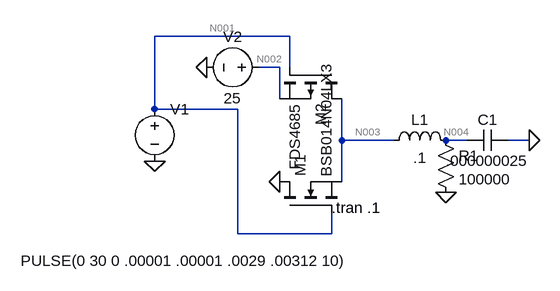
[diagram p0: schematic HornTankCircuit2.asc]
HornTankCircuit2.asc, the LTspice schematic file:
Version 4
SHEET 1 1100 680
WIRE -112 -48 -320 -48
WIRE -128 0 -160 0
WIRE -112 0 -112 -48
WIRE -128 48 -128 0
WIRE -320 64 -320 -48
WIRE -192 64 -320 64
WIRE -32 112 -32 48
WIRE 48 112 -32 112
WIRE 160 112 128 112
WIRE 256 112 224 112
WIRE -32 176 -32 112
WIRE -192 256 -192 64
WIRE -48 256 -48 224
WIRE -48 256 -192 256
FLAG -320 144 0
FLAG 256 112 0
FLAG 128 192 0
FLAG -128 176 0
FLAG -240 0 0
SYMBOL ind 32 128 R270
WINDOW 0 32 56 VTop 2
WINDOW 3 5 56 VBottom 2
SYMATTR InstName L1
SYMATTR Value .1
SYMBOL cap 160 128 R270
WINDOW 0 32 32 VTop 2
WINDOW 3 0 32 VBottom 2
SYMATTR InstName C1
SYMATTR Value .000000025
SYMBOL voltage -320 48 R0
WINDOW 123 0 0 Left 2
WINDOW 39 0 0 Left 2
WINDOW 3 -206 249 Left 2
SYMATTR InstName V1
SYMATTR Value PULSE(0 30 0 .00001 .00001 .0029 .00312 10)
SYMBOL res 112 96 R0
SYMATTR InstName R1
SYMATTR Value 100000
SYMBOL nmos -128 224 R270
SYMATTR InstName M1
SYMATTR Value BSB014N04LX3
SYMBOL pmos -32 0 R90
SYMATTR InstName M2
SYMATTR Value FDS4685
SYMBOL voltage -144 0 R90
WINDOW 0 -32 56 VBottom 2
WINDOW 3 32 56 VTop 2
WINDOW 123 0 0 Left 2
WINDOW 39 0 0 Left 2
SYMATTR InstName V2
SYMATTR Value 25
TEXT -48 216 Left 2 !.tran .1

The netlist it stands for:
* HornTankCircuit2.asc
L1 N003 N004 .1
C1 N004 0 .000000025
V1 N001 0 PULSE(0 30 0 .00001 .00001 .0029 .00312 10)
R1 N004 0 100000
M1 0 N001 N003 N003 BSB014N04LX3
M2 N003 N001 N002 N002 FDS4685
V2 N002 0 25
.model NMOS NMOS
.model PMOS PMOS
.lib standard.mos
.tran .1
.backanno
.end

* Results of the author's LTspice run, read from the files saved beside the schematic
* Operating Point, zero values left out:
*   V(n003) = 1.372 V
*   V(n004) = 1.372 V
*   V(n002) = 25 V
*   Id(M2) = -1.47 kA
*   Is(M2) = 1.47 kA
*   Id(M1) = -1.47 kA
*   Is(M1) = 1.47 kA
*   I(L1) = 13.72 µA
*   I(R1) = 13.72 µA
*   I(V2) = -1.47 kA
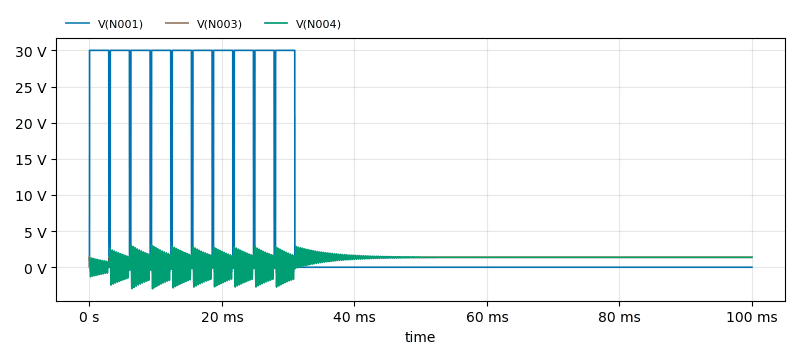
[diagram p1: Transient Analysis of HornTankCircuit2.asc, plotted from the saved traces]
* Transient Analysis, 1 run:
*   V(N001): min 0 V, max 30 V, average 8.73 V, rms 16.17 V, last 0 V
*   V(N003): min -58.22 µV, max 1.372 V, average 972.4 mV, rms 1.155 V, last 1.372 V
*   V(N004): min -2.981 V, max 3.113 V, average 972.5 mV, rms 1.421 V, last 1.372 V